# EAGLE design umi9s (EAGLE 8.7.1)

## Sheet 1 of 2: POWER
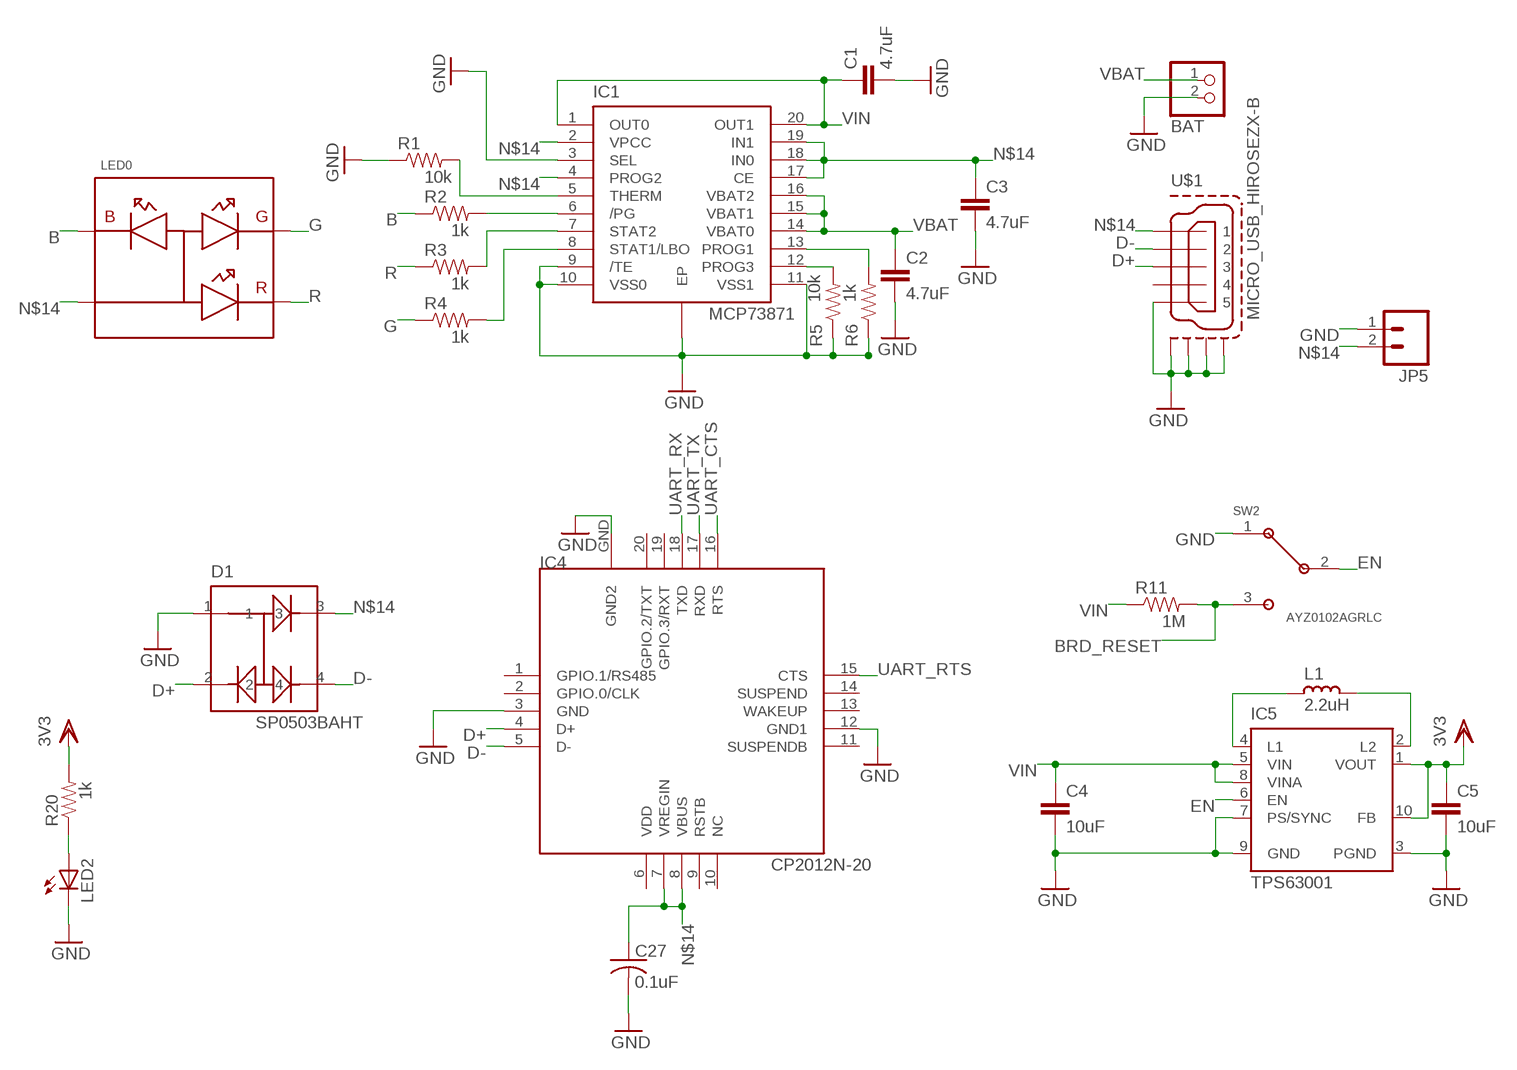
[diagram p0: schematic, sheet 1]

### Parts
BAT  JST_2PIN-SMT  [JST-PH-2-SMT]
C1  4.7uF  C-EUC2012  [C2012]
C2  4.7uF  C-EUC2012  [C2012]
C3  4.7uF  C-EUC2012  [C2012]
C4  10uF  C-EUC2012  [C2012]
C5  10uF  C-EUC2012  [C2012]
C27  0.1uF  C-USC0402  [C0402]
D1  SP0503BAHT  [SOT143]
IC1  MCP73871  [QFN20]
IC4  CP2012N-20  [CP2102-QFN20]
IC5  TPS63001  TPS6300  [DRC-S-PVSON-N10]
JP5  M02PTH  [1X02]
L1  2.2uH  L_1210  [L1210]
LED0  APFA2507LQBDSEEZGKC  [2507_RA_SMD_LED]
LED2  LEDCHIPLED_0603  [CHIPLED_0603]
R1  10k  RESISTOR0402-RES  [0402-RES]
R2  1k  RESISTOR0402-RES  [0402-RES]
R3  1k  RESISTOR0402-RES  [0402-RES]
R4  1k  RESISTOR0402-RES  [0402-RES]
R5  10k  RESISTOR0402-RES  [0402-RES]
R6  1k  RESISTOR0402-RES  [0402-RES]
R11  1M  RESISTOR0402-RES  [0402-RES]
R20  1k  RESISTOR0402-RES  [0402-RES]
SW2  AYZ0102AGRLC  [AYZ0102AGRLC]
U$1  MICRO_USB_HIROSEZX-B  [MICRO_USB_HIROSE_B]

### Nets
B: LED0.1(B) R2.1
BRD_RESET: R11.2 SW2.3 ; also sheet 2
D+: D1.2 IC4.4(D+) U$1.P$3
D-: D1.4 IC4.5(D-) U$1.P$2
EN: IC5.6(EN) SW2.2
G: LED0.4(G) R4.1
GND: BAT.2 C1.2 C2.2 C3.2 C4.2 C5.2 C27.2 D1.1 IC1.3(SEL) IC1.9(/TE) IC1.10(VSS0) IC1.11(VSS1) IC1.EP IC4.3(GND) IC4.12(GND1) IC4.GND(GND2) IC5.3(PGND) IC5.7(PS/SYNC) IC5.9(GND) JP5.1 LED2.C R1.1 R5.1 R6.1 SW2.1 U$1.P$5 U$1.S1 U$1.S2 U$1.S3 U$1.S4 ; also sheet 2
N$1: IC5.4(L1) L1.2
N$2: IC5.2(L2) L1.1
N$14: C3.1 C27.1 D1.3 IC1.2(VPCC) IC1.4(PROG2) IC1.17(CE) IC1.18(IN0) IC1.19(IN1) IC4.7(VREGIN) IC4.8(VBUS) JP5.2 LED0.2(A) U$1.P$1
N$17: IC1.6(/PG) R2.2
N$18: IC1.7(STAT2) R3.2
N$19: LED2.A R20.1
N$29: IC1.8(STAT1/LBO) R4.2
N$30: IC1.5(THERM) R1.2
N$31: IC1.12(PROG3) R5.2
N$32: IC1.13(PROG1) R6.2
R: LED0.3(R) R3.1
UART_CTS: IC4.16(RTS) ; also sheet 2
UART_RTS: IC4.15(CTS) ; also sheet 2
UART_RX: IC4.18(TXD) ; also sheet 2
UART_TX: IC4.17(RXD) ; also sheet 2
VBAT: BAT.1 C2.1 IC1.14(VBAT0) IC1.15(VBAT1) IC1.16(VBAT2)
VDD: C5.1 IC5.1(VOUT) IC5.10(FB) R20.2 ; supply symbol labelled 3V3 ; also sheet 2
VIN: C1.1 C4.1 IC1.1(OUT0) IC1.20(OUT1) IC5.5(VIN) IC5.8(VINA) R11.1
Unconnected: IC4.1(GPIO.1/RS485) IC4.2(GPIO.0/CLK) IC4.9(RSTB) IC4.10(NC) IC4.11(SUSPENDB) IC4.13(WAKEUP) IC4.14(SUSPEND) IC4.19(GPIO.3/RXT) IC4.20(GPIO.2/TXT) IC5.TH U$1.P$4

## Sheet 2 of 2: BGM123
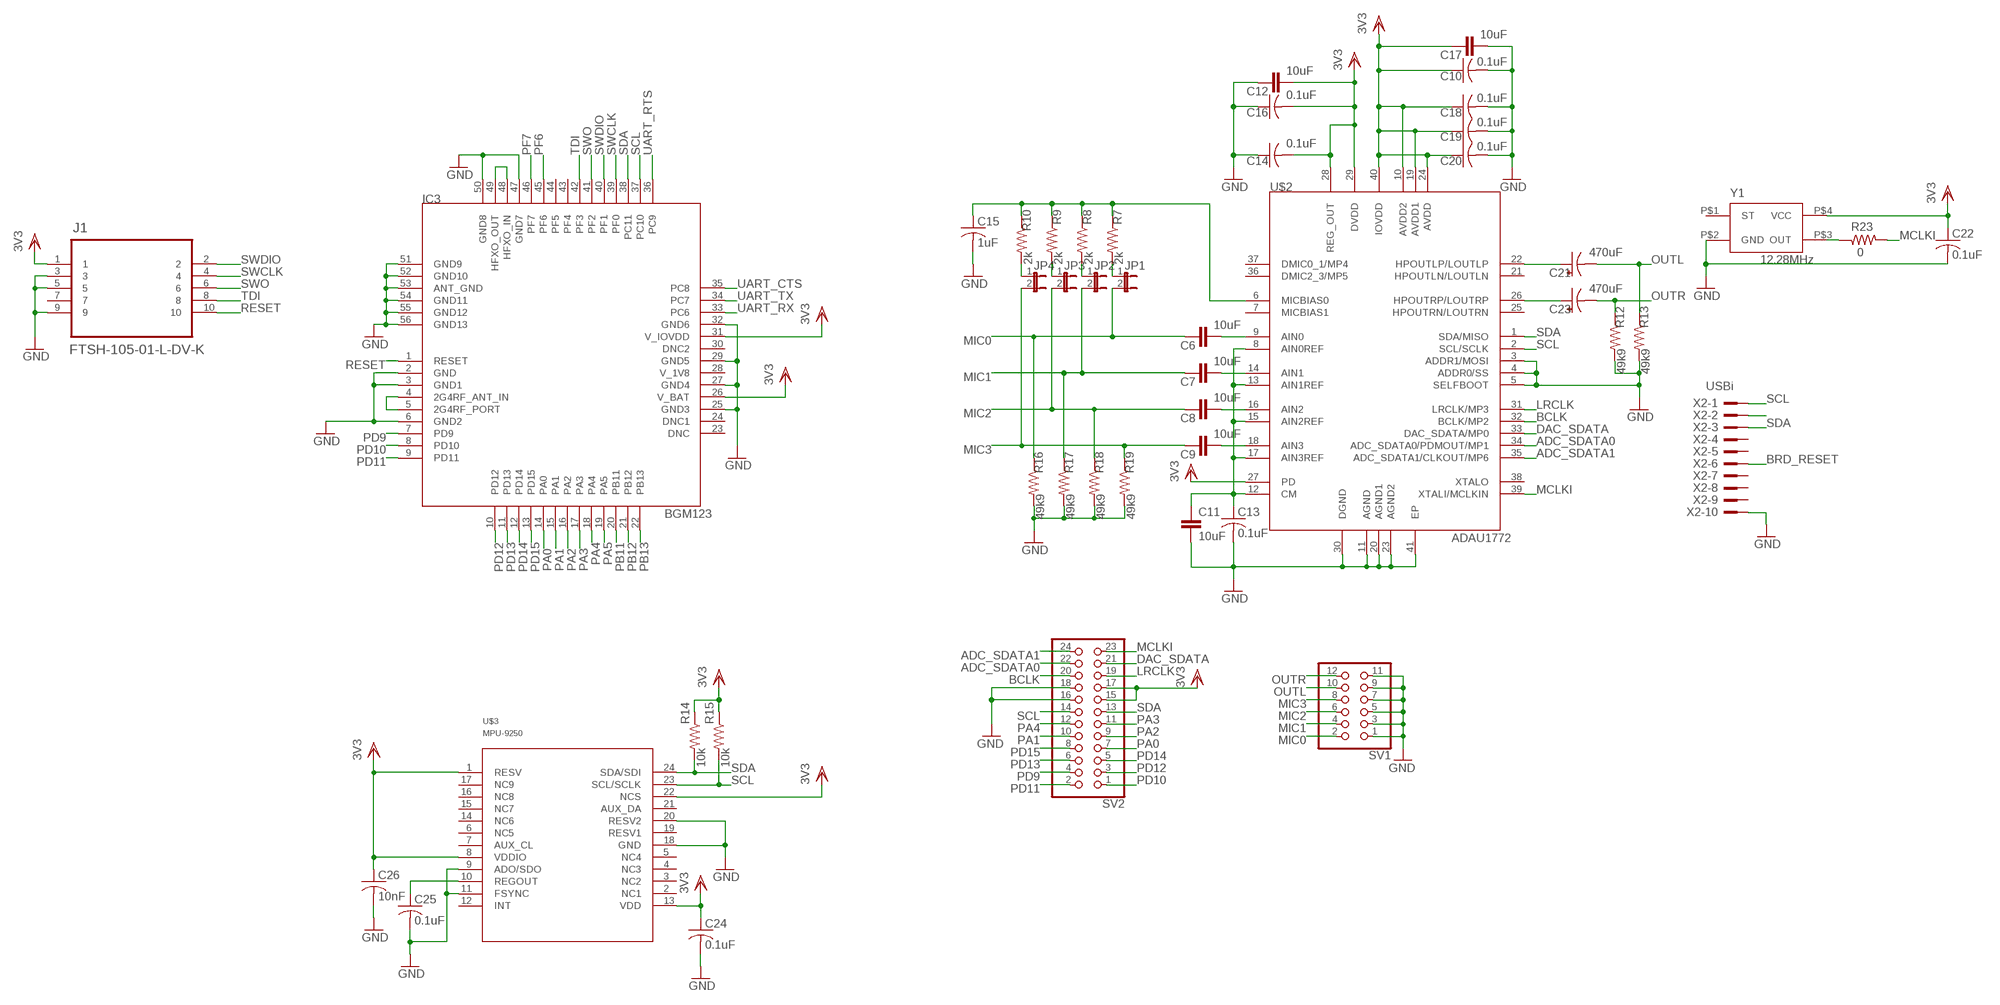
[diagram p1: schematic, sheet 2]

### Parts
C6  10uF  C-EUC2012  [C2012]
C7  10uF  C-EUC2012  [C2012]
C8  10uF  C-EUC2012  [C2012]
C9  10uF  C-EUC2012  [C2012]
C10  0.1uF  C-USC0402  [C0402]
C11  10uF  C-EUC2012  [C2012]
C12  10uF  C-EUC2012  [C2012]
C13  0.1uF  C-USC0402  [C0402]
C14  0.1uF  C-USC0402  [C0402]
C15  1uF  C-USC0402  [C0402]
C16  0.1uF  C-USC0402  [C0402]
C17  10uF  C-EUC2012  [C2012]
C18  0.1uF  C-USC0402  [C0402]
C19  0.1uF  C-USC0402  [C0402]
C20  0.1uF  C-USC0402  [C0402]
C21  470uF  CPOL-USB/3528-21R  [B/3528-21R]
C22  0.1uF  C-USC0402  [C0402]
C23  470uF  CPOL-USB/3528-21R  [B/3528-21R]
C24  0.1uF  C-USC0402  [C0402]
C25  0.1uF  C-USC0402  [C0402]
C26  10nF  C-USC0402  [C0402]
IC3  BGM123  BGM12X  [BGM12X]
J1  FTSH-105-01-L-DV-K  [SAMTEC_FTSH-105-01-L-DV-K]
JP1  JUMPER-2SMD-NO  [SJ_2S-NO]
JP2  JUMPER-2SMD-NO  [SJ_2S-NO]
JP3  JUMPER-2SMD-NO  [SJ_2S-NO]
JP4  JUMPER-2SMD-NO  [SJ_2S-NO]
R7  2k  RESISTOR0402-RES  [0402-RES]
R8  2k  RESISTOR0402-RES  [0402-RES]
R9  2k  RESISTOR0402-RES  [0402-RES]
R10  2k  RESISTOR0402-RES  [0402-RES]
R12  49k9  RESISTOR0402-RES  [0402-RES]
R13  49k9  RESISTOR0402-RES  [0402-RES]
R14  10k  RESISTOR0402-RES  [0402-RES]
R15  10k  RESISTOR0402-RES  [0402-RES]
R16  49k9  RESISTOR0402-RES  [0402-RES]
R17  49k9  RESISTOR0402-RES  [0402-RES]
R18  49k9  RESISTOR0402-RES  [0402-RES]
R19  49k9  RESISTOR0402-RES  [0402-RES]
R23  0  RESISTOR0402-RES  [0402-RES]
SV1  PINHD-2X06  [2X06ROUND]
SV2  PINHD-2X12  [2X12ROUND]
U$2  ADAU1772  [QFN40_600X600]
U$3  MPU-9250  [LEAD-QFN24]
X2  USBi  2510-  [PAK100/2500-10]
Y1  12.28MHz  XTAL-OSC  [SG-210]

### Nets
ADC_SDATA0: SV2.22 U$2.34(ADC_SDATA0/PDMOUT/MP1)
ADC_SDATA1: SV2.24 U$2.35(ADC_SDATA1/CLKOUT/MP6)
AIN0: C6.2 U$2.9(AIN0)
AIN1: C7.2 U$2.14(AIN1)
AIN2: C8.2 U$2.16(AIN2)
AIN3: C9.2 U$2.18(AIN3)
BCLK: SV2.20 U$2.32(BCLK/MP2)
BRD_RESET: X2.6 ; also sheet 1
CM: C11.1 C13.1 U$2.8(AIN0REF) U$2.12(CM) U$2.13(AIN1REF) U$2.15(AIN2REF) U$2.17(AIN3REF)
DAC_SDATA: SV2.21 U$2.33(DAC_SDATA/MP0)
GND: C10.2 C11.2 C12.1 C13.2 C14.1 C15.2 C16.1 C17.2 C18.2 C19.2 C20.2 C22.2 C24.2 C25.2 C26.2 IC3.2(GND) IC3.3(GND1) IC3.6(GND2) IC3.25(GND3) IC3.27(GND4) IC3.29(GND5) IC3.32(GND6) IC3.47(GND7) IC3.50(GND8) IC3.51(GND9) IC3.52(GND10) IC3.53(ANT_GND) IC3.54(GND11) IC3.55(GND12) IC3.56(GND13) J1.3 J1.5 J1.9 R12.2 R13.2 R16.2 R17.2 R18.2 R19.2 SV1.1 SV1.3 SV1.5 SV1.7 SV1.9 SV1.11 SV2.16 SV2.18 U$2.3(ADDR1/MOSI) U$2.4(ADDR0/SS) U$2.5(SELFBOOT) U$2.11(AGND) U$2.20(AGND1) U$2.23(AGND2) U$2.30(DGND) U$2.41(EP) U$3.9(ADO/SDO) U$3.11(FSYNC) U$3.18(GND) U$3.20(RESV2) X2.10 Y1.P$2(GND) ; also sheet 1
HPOUTL: C21.+ U$2.22(HPOUTLP/LOUTLP)
HPOUTR: C23.+ U$2.26(HPOUTRP/LOUTRP)
LRCLK: SV2.19 U$2.31(LRCLK/MP3)
MCLKI: R23.2 SV2.23 U$2.39(XTALI/MCLKIN)
MIC0: C6.1 JP1.2 R16.1 SV1.2
MIC1: C7.1 JP2.2 R17.1 SV1.4
MIC2: C8.1 JP3.2 R18.1 SV1.6
MIC3: C9.1 JP4.2 R19.1 SV1.8
MICBIAS0: C15.1 R7.1 R8.1 R9.1 R10.1 U$2.6(MICBIAS0)
N$3: IC3.48(HFXO_IN) IC3.49(HFXO_OUT)
N$4: IC3.4(2G4RF_ANT_IN) IC3.5(2G4RF_PORT)
N$5: C25.1 U$3.10(REGOUT)
N$6: JP1.1 R7.2
N$7: JP2.1 R8.2
N$8: JP3.1 R9.2
N$9: R23.1 Y1.P$3(OUT)
N$10: JP4.1 R10.2
N$11: X2.2
OUTL: C21.- R13.1 SV1.10
OUTR: C23.- R12.1 SV1.12
PA0: IC3.14(PA0) SV2.7
PA1: IC3.15(PA1) SV2.10
PA2: IC3.16(PA2) SV2.9
PA3: IC3.17(PA3) SV2.11
PA4: IC3.18(PA4) SV2.12
PA5: IC3.19(PA5)
PB11: IC3.20(PB11)
PB12: IC3.21(PB12)
PB13: IC3.22(PB13)
PD9: IC3.7(PD9) SV2.4
PD10: IC3.8(PD10) SV2.1
PD11: IC3.9(PD11) SV2.2
PD12: IC3.10(PD12) SV2.3
PD13: IC3.11(PD13) SV2.6
PD14: IC3.12(PD14) SV2.5
PD15: IC3.13(PD15) SV2.8
PF6: IC3.45(PF6)
PF7: IC3.46(PF7)
RESET: IC3.1(RESET) J1.10
SCL: IC3.37(PC10) R15.2 SV2.14 U$2.2(SCL/SCLK) U$3.23(SCL/SCLK) X2.1
SDA: IC3.38(PC11) R14.2 SV2.13 U$2.1(SDA/MISO) U$3.24(SDA/SDI) X2.3
SWCLK: IC3.39(PF0) J1.4
SWDIO: IC3.40(PF1) J1.2
SWO: IC3.41(PF2) J1.6
TDI: IC3.42(PF3) J1.8
UART_CTS: IC3.35(PC8) ; also sheet 1
UART_RTS: IC3.36(PC9) ; also sheet 1
UART_RX: IC3.33(PC6) ; also sheet 1
UART_TX: IC3.34(PC7) ; also sheet 1
VDD: C10.1 C12.2 C14.2 C16.2 C17.1 C18.1 C19.1 C20.1 C22.1 C24.1 C26.1 IC3.26(V_BAT) IC3.31(V_IOVDD) J1.1 R14.1 R15.1 SV2.15 SV2.17 U$2.10(AVDD2) U$2.19(AVDD1) U$2.24(AVDD) U$2.27(PD) U$2.28(REG_OUT) U$2.29(DVDD) U$2.40(IOVDD) U$3.1(RESV) U$3.8(VDDIO) U$3.13(VDD) U$3.22(NCS) Y1.P$4(VCC) ; supply symbol labelled 3V3 ; also sheet 1
Unconnected: IC3.23(DNC) IC3.24(DNC1) IC3.43(PF4) IC3.44(PF5) J1.7 U$2.7(MICBIAS1) U$2.21(HPOUTLN/LOUTLN) U$2.25(HPOUTRN/LOUTRN) U$2.36(DMIC2_3/MP5) U$2.37(DMIC0_1/MP4) U$2.38(XTALO) U$3.2(NC1) U$3.3(NC2) U$3.4(NC3) U$3.5(NC4) U$3.6(NC5) U$3.7(AUX_CL) U$3.12(INT) U$3.14(NC6) U$3.15(NC7) U$3.16(NC8) U$3.17(NC9) U$3.19(RESV1) U$3.21(AUX_DA) X2.4 X2.5 X2.7 X2.8 X2.9 Y1.P$1(ST)

## Power pins joined to a net without a drawn wire
DNC2: IC3.30(DNC2)
V_1V8: IC3.28(V_1V8)
VDD: IC4.6(VDD)

## Library data of the parts
BAT = tkrworks:JST_2PIN: JST 2-Pin Connectors of various flavors SMT-RA (S2B-PH-SM4) 4UConnector #17311 SMT (B2B-PH-SM4) THM-RA (S2B-PH) THM (B2B-PH)
C1-C9 C11 C12 C17 = rcl:C-EU: CAPACITOR, European symbol
C10 C13-C16 C18-C20 C22 C24-C27 = rcl:C-US: CAPACITOR, American symbol; SPICEPREFIX: C
C21 C23 = rcl:CPOL-US: POLARIZED CAPACITOR, American symbol; SPICEPREFIX: C
D1 = tkrworks:SP0503BAHT
IC1 = tkrworks:MCP73871
IC3 = tkrworks:BGM12X
IC4 = tkrworks:CP2012N-20
IC5 = texas:TPS6300*: HIGH EFFICIENT SINGLE INDUCTOR BUCK-BOOST CONVERTER WITH 1.8-A SWITCHES Source: http://focus.ti.com/lit/ds/symlink/tps63001.pdf; MPN: TPS63000DRCTG4; OC_FARNELL: 1511852; OC_NEWARK: 59M7217
J1 = SAMTEC-HTSW-FTxx_By_element14_Batch_1:FTSH-105-01-L-DV-K: CONN HEADER, 1.27MM, 2X5WAY, SMT; MPN: FTSH-105-01-L-DV-K; OC_FARNELL: -; OC_NEWARK: 02M8557; PACKAGE: HEADER, 1.27MM, 2X5WAY, SMT; SUPPLIER: SAMTEC
JP1-JP4 = SparkFun:JUMPER-2: Jumper Basic 0.1" spaced jumper. Use with breakaway headers.
JP5 = SparkFun:M02: Header 2 Standard 2-pin 0.1" header. Use with straight break away headers (SKU : PRT-00116), right angle break away headers (PRT-00553), swiss pins (PRT-00743), machine pins (PRT-00117), and female headers (PRT-00115). Molex polarized connector foot print use with SKU : PRT-08233 with associated crimp pins and housings.
L1 = rc-master-smd:L_: INDUCTOR
LED0 = tkrworks:APFA2507LQBDSEEZGKC
LED2 = led:LED: LED OSRAM: - CHIPLED LG R971, LG N971, LY N971, LG Q971, LY Q971, LO R971, LY R971 LH N974, LH R974 LS Q976, LO Q976, LY Q976 LO Q996 - Hyper CHIPLED LW Q18S LB Q993, LB Q99A, LB R99A - SideLED LS A670, LO A670, LY A670, LG A670, LP A670 LB A673, LV A673, LT A673, LW A673 LH A674 LY A675 LS A676, LA A676, LO A676, LY A676, LW A676 LS A679, LY A679, LG A679 - Hyper Micro SIDELED® LS Y876, LA Y876, LO Y876, LY Y876 LT Y87S - SmartLED LW L88C, LW L88S LB L89C, LB L89S, LG L890 LS L89K, LO L89K, LY L89K LS L896, LA L896, LO L896, LY L896 - TOPLED LS T670, LO T670, LY T670, LG T670, LP T670 LSG T670, LSP T670, LSY T670, LOP T670, LYG T670 LG T671, LOG T671, LSG T671 LB T673, LV T673, LT T673, LW T673 LH T674 LS T676, LA T676, LO T676, LY T676, LB T676, LH T676, LSB T676, LW T676 LB T67C, LV T67C, LT T67C, LS T67K, LO T67K, LY T67K, LW E67C LS E67B, LA E67B, LO E67B, LY E67B, LB E67C, LV E67C, LT E67C LW T67C LS T679, LY T679, LG T679 LS T770, LO T770, LY T770, LG T770, LP T770 LB T773, LV T773, LT T773, LW T773 LH T774 LS E675, LA E675, LY E675, LS T675 LS T776, LA T776, LO T776, LY T776, LB T776 LHGB T686 LT T68C, LB T68C - Hyper Mini TOPLED® LB M676 - Mini TOPLED Santana® LG M470 LS M47K, LO M47K, LY M47K Source: http://www.osram.convergy.de LUXEON: - LUMILED® LXK2-PW12-R00, LXK2-PW12-S00, LXK2-PW14-U00, LXK2-PW14-V00 LXK2-PM12-R00, LXK2-PM12-S00, LXK2-PM14-U00 LXK2-PE12-Q00, LXK2-PE12-R00, LXK2-PE12-S00, LXK2-PE14-T00, LXK2-PE14-U00 LXK2-PB12-K00, LXK2-PB12-L00, LXK2-PB12-M00, LXK2-PB14-N00, LXK2-PB14-P00, LXK2-PB14-Q00 LXK2-PR12-L00, LXK2-PR12-M00, LXK2-PR14-Q00, LXK2-PR14-R00 LXK2-PD12-Q00, LXK2-PD12-R00, LXK2-PD12-S00 LXK2-PH12-R00, LXK2-PH12-S00 LXK2-PL12-P00, LXK2-PL12-Q00, LXK2-PL12-R00 Source: www.luxeon.com KINGBRIGHT: KA-3528ASYC Source: www.kingbright.com
R1-R20 R23 = SparkFun:RESISTOR: Resistor Basic schematic elements and footprints for 0603, 1206, and PTH resistors.
SV1 = pinhead-2:PINHD-2X06: PIN HEADER
SV2 = pinhead-2:PINHD-2X12: PIN HEADER
SW2 = tkrworks:AYZ0102AGRLC
U$1 = tkrworks:MICRO_USB_HIROSE
U$2 = tkrworks:ADAU1772
U$3 = invensense:MPU-9250
X2 = con-3m:2510-: 3M (TM) Pak 100 4-Wall Header Source: 3M; MF: 3M; MPN: 2510-6002UB; OC_FARNELL: 9838244; OC_NEWARK: 46F4725
Y1 = tkrworks2:XTAL-OSC

## Net classes
1 OUT: width 0.406 mm

## Board
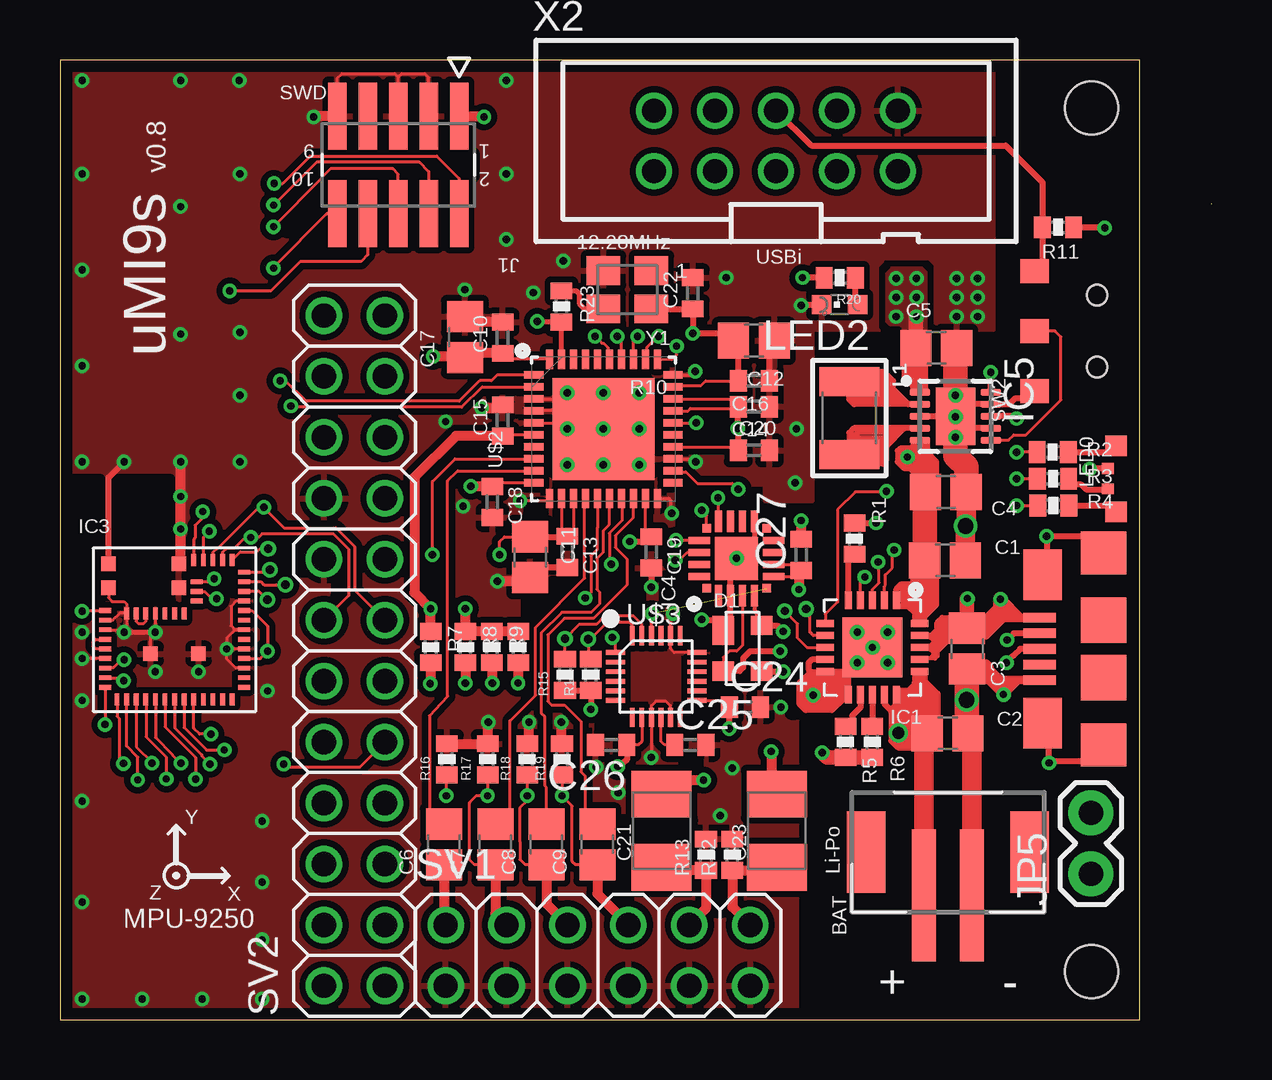
[diagram p2: board, top side]
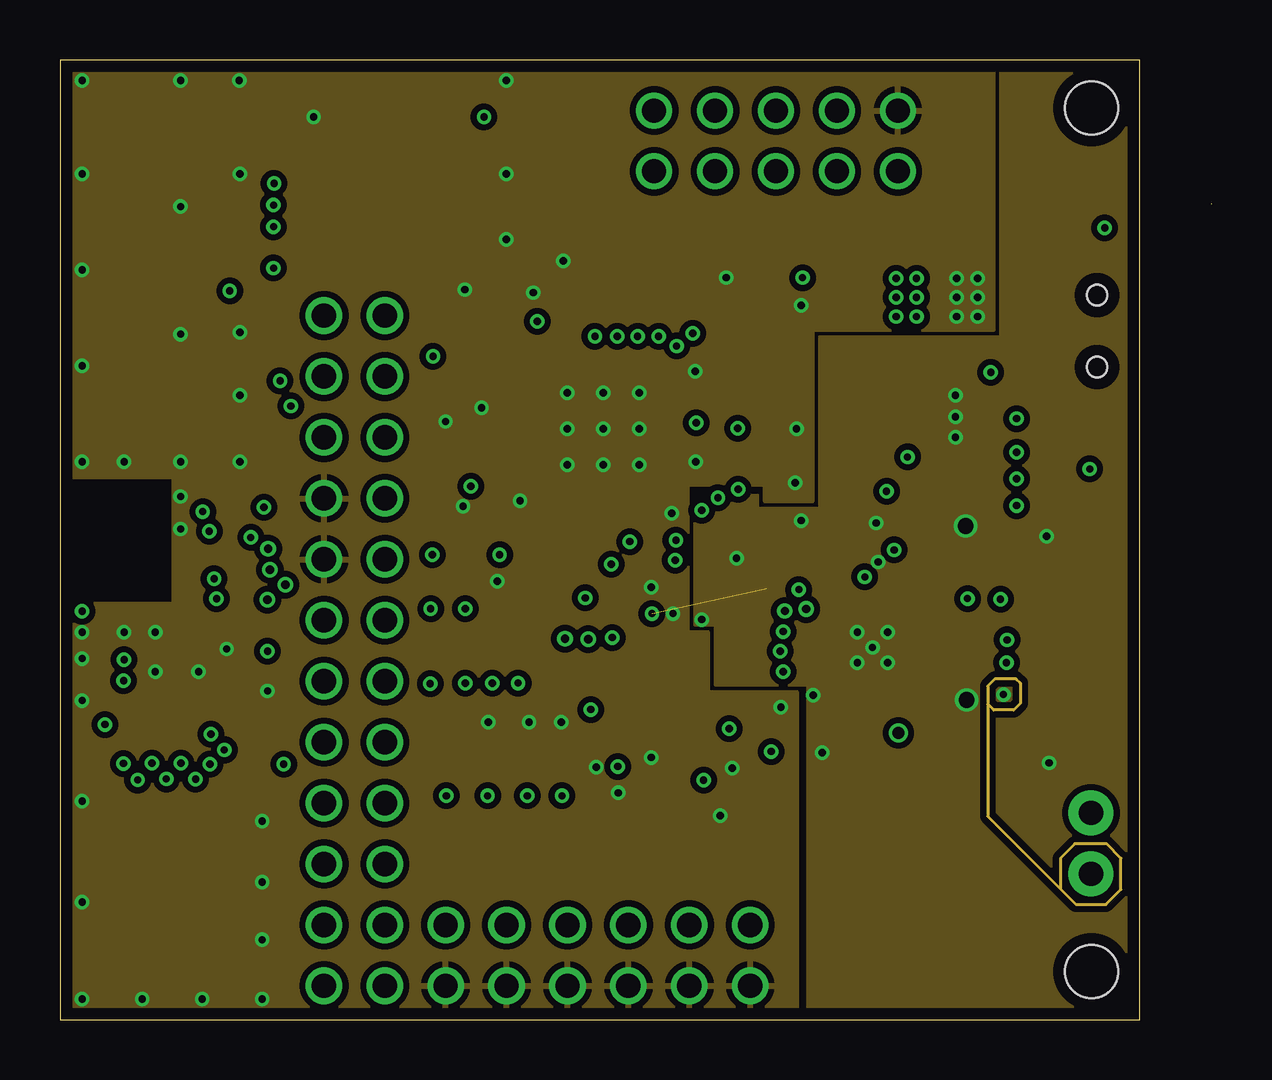
[diagram p3: board, inner layer Route2]
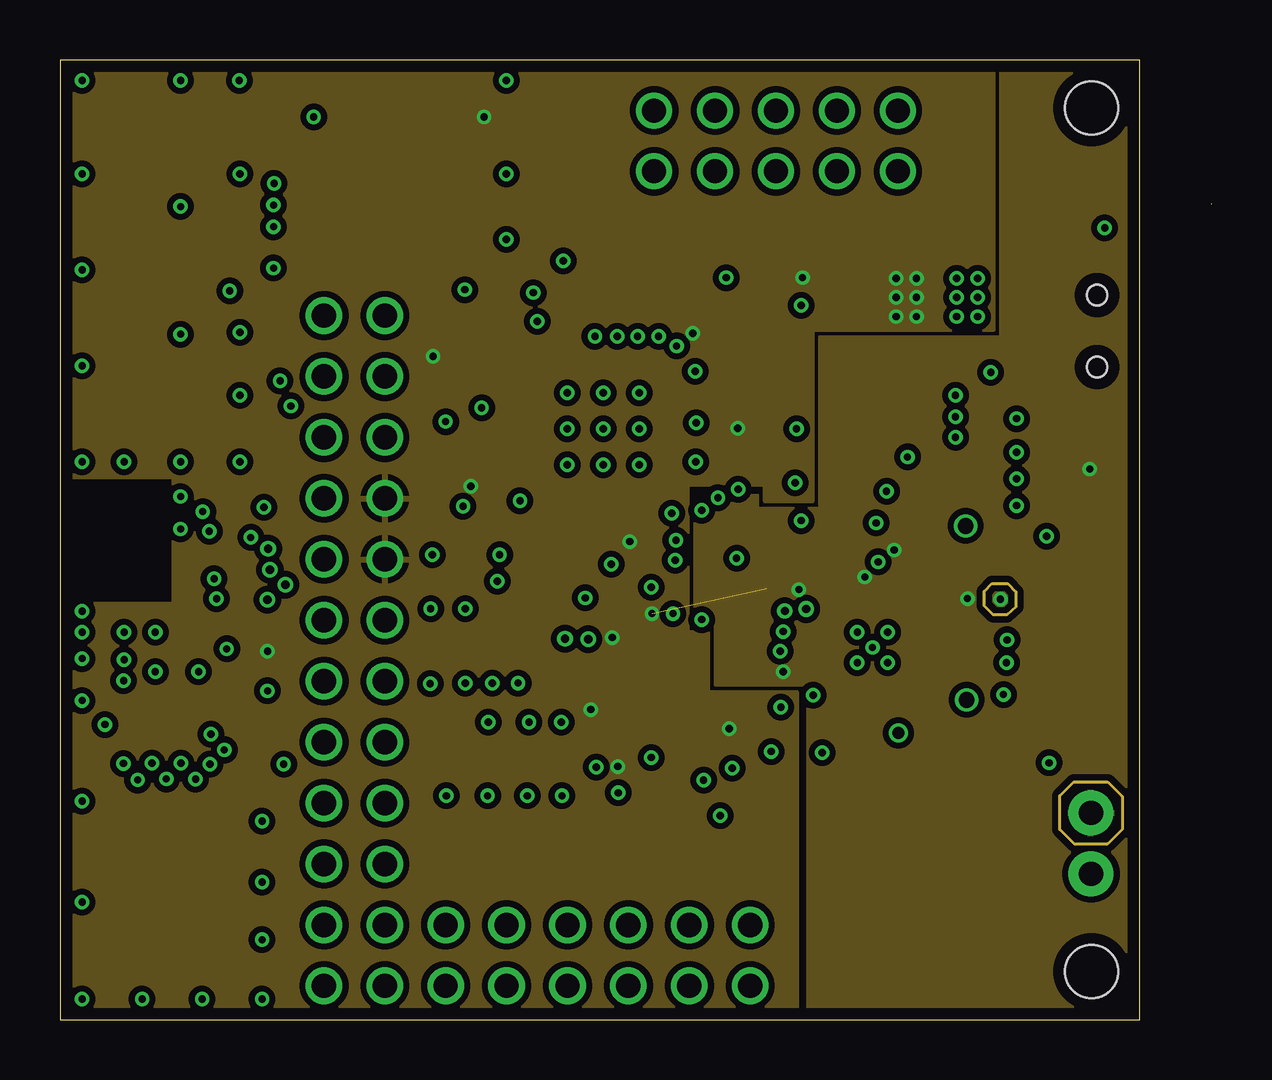
[diagram p4: board, inner layer Route3]
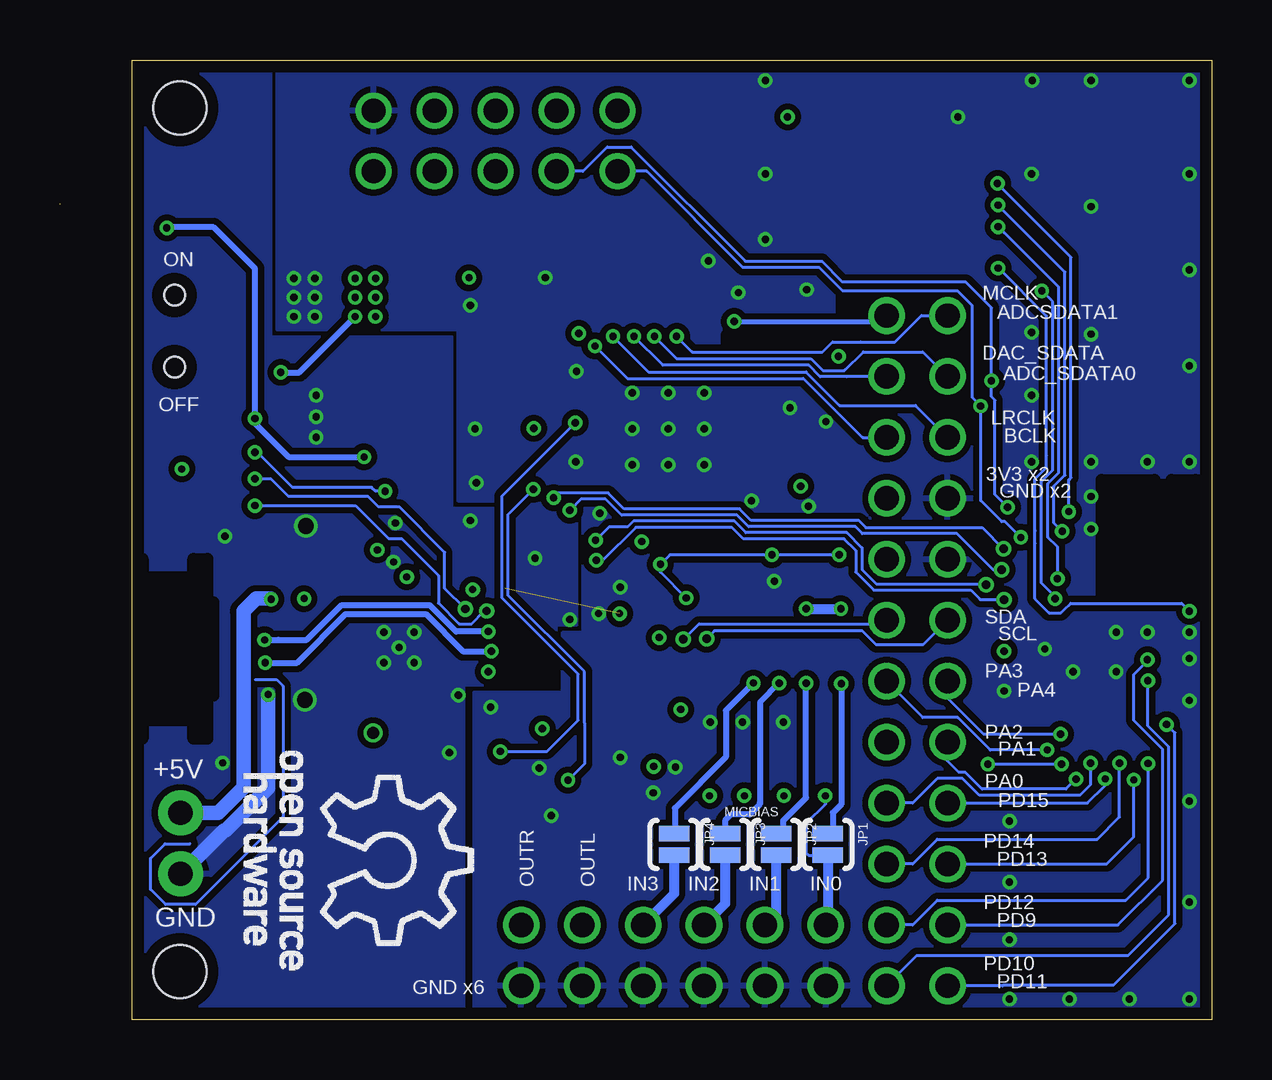
[diagram p5: board, bottom side, seen from below]

Size 48 x 40 mm. Coordinates in mm from the lower left corner, seen from the top.
Outline: 48,34 arc0 48,34.01
Outline: 0,0 45,0 45,40 0,40 0,0
Copper layers (1+2*3+16): Top 0.018mm / dielectric 0.25mm / Route2 0.035mm / dielectric 1mm / Route3 0.035mm / dielectric 0.2mm / Bottom 0.018mm
Design rules "pban_5mil-l4-a *": minimum track width 5mil, minimum drill 0.3mm, track to track 0.125mm, track to pad 0.2mm, pad to pad 0.125mm, via to via 0.125mm, smd to smd 0.125mm, copper to edge 0.5mm, drill to drill 0.5mm, minimum pad ring 0.15mm, minimum via ring 0.15mm, stop-mask expansion 4mil, vias tented up to drill 0.35mm, thermal gap 10mil
Holes 2.2 mm at 43,2 43,38
tRestrict: area 1.6,16.4 to 2.1,16.6; area 22.4,22.4 to 22.9,22.5; area 20.4,24.4 to 20.5,24.8; area 22.4,26.8 to 22.9,26.9; area 24.8,24.4 to 24.9,24.8; area 19.6,25.5 to 19.9,25.7; area 19.6,25 to 19.9,25.2; area 14.5,37.5 to 15,37.8; area 23.8,17 to 24.2,18.3; area 25.2,17.4 to 26.1,18.5; area 26,16.8 to 26.3,17.3; area 19.5,21.1 to 20.1,21.5; 21 more areas
bRestrict: area 37.8,15.4 to 38.8,15.7; area 14.3,28.4 to 19.4,28.9; area 14.4,29.3 to 15.4,30.1; area 19.6,28.1 to 20.2,28.6

### Footprints (pad centres in the part's own frame; a part is rotated, then mirrored left to right if it is on the bottom)
JST-PH-2-SMT = smd 1 x 5.5: 1 -1,-1.8; 2 1,-1.8 | smd 1.6 x 3.4: NC1 -3.4,0; NC2 3.4,0
C2012 = smd 1.3 x 1.5: 1 -0.85,0; 2 0.85,0
C0402 = smd 0.7 x 0.9: 1 -0.65,0; 2 0.65,0
B/3528-21R = smd 1.95 x 2.5: + 1.525,0; - -1.525,0
SOT143 = smd 0.9 x 1.2: 1 -0.8,0.75 | smd 0.9 x 0.8: 2 -0.8,-0.95; 3 0.8,-0.95; 4 0.8,0.95
QFN20 = smd 0.73 x 0.3: 1 -1.965,1; 2 -1.965,0.5; 3 -1.965,0; 4 -1.965,-0.5; 5 -1.965,-1; 11 1.965,-1; 12 1.965,-0.5; 13 1.965,0; 14 1.965,0.5; 15 1.965,1 | smd 0.3 x 0.73: 6 -1,-1.965; 7 -0.5,-1.965; 8 0,-1.965; 9 0.5,-1.965; 10 1,-1.965; 16 1,1.965; 17 0.5,1.965; 18 0,1.965; 19 -0.5,1.965; 20 -1,1.965 | smd 2.5 x 2.5: EP 0,0
BGM12X = smd 0.5 x 0.2: 1 -0.15,-1.95; 2 -0.15,-2.35; 3 -0.15,-2.75; 4 -0.15,-3.15; 5 -0.15,-3.55; 6 -0.15,-3.95; 7 -0.15,-4.35; 8 -0.15,-4.75; 9 -0.15,-5.15; 23 5.65,-5.15; 24 5.65,-4.75; 25 5.65,-4.35; 26 5.65,-3.95; 27 5.65,-3.55; 28 5.65,-3.15; 29 5.65,-2.75; 30 5.65,-2.35; 31 5.65,-1.95; 32 5.65,-1.55; 33 5.65,-1.15; 34 5.65,-0.75; 35 5.65,-0.35; 41 3.675,-0.75; 42 3.675,-1.15; 43 3.675,-1.55 | smd 0.2 x 0.5: 10 0.35,-5.65; 11 0.75,-5.65; 12 1.15,-5.65; 13 1.55,-5.65; 14 1.95,-5.65; 15 2.35,-5.65; 16 2.75,-5.65; 17 3.15,-5.65; 18 3.55,-5.65; 19 3.95,-5.65; 20 4.35,-5.65; 21 4.75,-5.65; 22 5.15,-5.65; 36 5.15,0.15; 37 4.75,0.15; 38 4.35,0.15; 39 3.95,0.15; 40 3.55,0.15; 44 3.15,-2.075; 45 2.75,-2.075; 46 2.35,-2.075; 47 1.95,-2.075; 48 1.55,-2.075; 49 1.15,-2.075; 50 0.75,-2.075 | smd 0.6 x 0.6: 51 1.75,-3.75; 52 3.75,-3.75; 53 0,0; 54 0,-1; 55 2.925,-1; 56 2.925,0
CP2102-QFN20 = smd 0.35 x 0.35: 1 -1.25,1.25; 6 -1.25,-1.25; 11 1.25,-1.25; 16 1.25,1.25 | smd 0.9 x 0.3: 2 -1.55,0.75; 3 -1.55,0.25; 4 -1.55,-0.25; 5 -1.55,-0.75; 12 1.55,-0.75; 13 1.55,-0.25; 14 1.55,0.25; 15 1.55,0.75 | smd 0.3 x 0.9: 7 -0.75,-1.55; 8 -0.25,-1.55; 9 0.25,-1.55; 10 0.75,-1.55; 17 0.75,1.55; 18 0.25,1.55; 19 -0.25,1.55; 20 -0.75,1.55 | smd 1.8 x 1.8: GND 0,0
DRC-S-PVSON-N10 = smd 0.28 x 0.85: 1 -1,-1.475; 2 -0.5,-1.475; 3 0,-1.475; 4 0.5,-1.475; 5 1,-1.475; 6 1,1.475; 7 0.5,1.475; 8 0,1.475; 9 -0.5,1.475; 10 -1,1.475 | smd 2.4 x 1.65: TH 0,0
SAMTEC_FTSH-105-01-L-DV-K = smd 0.762 x 2.794: 1 -2.54,-2.032; 2 -2.54,2.032; 3 -1.27,-2.032; 4 -1.27,2.032; 5 0,-2.032; 6 0,2.032; 7 1.27,-2.032; 8 1.27,2.032; 9 2.54,-2.032; 10 2.54,2.032
SJ_2S-NO = smd 0.635 x 1.27: 1 -0.45,0; 2 0.45,0
1X02 = drill 1.016 pad 1.88: 1 0,0; 2 2.54,0
L1210 = smd 1.2 x 2.5: 1 -1.524,0; 2 1.524,0
2507_RA_SMD_LED = smd 0.85 x 0.9: 1 -1.375,0; 4 1.375,0 | smd 0.45 x 0.5: 2 -0.425,-0.35; 3 0.425,-0.35
CHIPLED_0603 = smd 0.8 x 0.8: A 0,-0.75; C 0,0.75
0402-RES = smd 0.7 x 0.9: 1 -0.65,0; 2 0.65,0
2X06ROUND = drill 1.016: 1 -6.35,-1.27; 2 -6.35,1.27; 3 -3.81,-1.27; 4 -3.81,1.27; 5 -1.27,-1.27; 6 -1.27,1.27; 7 1.27,-1.27; 8 1.27,1.27; 9 3.81,-1.27; 10 3.81,1.27; 11 6.35,-1.27; 12 6.35,1.27
2X12ROUND = drill 1.016: 1 -13.97,-1.27; 2 -13.97,1.27; 3 -11.43,-1.27; 4 -11.43,1.27; 5 -8.89,-1.27; 6 -8.89,1.27; 7 -6.35,-1.27; 8 -6.35,1.27; 9 -3.81,-1.27; 10 -3.81,1.27; 11 -1.27,-1.27; 12 -1.27,1.27; 13 1.27,-1.27; 14 1.27,1.27; 15 3.81,-1.27; 16 3.81,1.27; 17 6.35,-1.27; 18 6.35,1.27; 19 8.89,-1.27; 20 8.89,1.27; 21 11.43,-1.27; 22 11.43,1.27; 23 13.97,-1.27; 24 13.97,1.27
AYZ0102AGRLC = smd 1 x 1.2: 1 -2.5,2.6; 2 0,2.6; 3 2.5,2.6 | hole 0.85: -1.5,0; 1.5,0
MICRO_USB_HIROSE_B = smd 0.4 x 1.35: P$1 1.3,2.675; P$2 0.65,2.675; P$3 0,2.675; P$4 -0.65,2.675; P$5 -1.3,2.675 | smd 2.1 x 1.6: S1 3.1,2.55; S2 -3.1,2.55 | smd 1.8 x 1.9: S3 4,0; S4 -4,0 | smd 1.9 x 1.9: S5 -1.2,0; S6 1.2,0
QFN40_600X600 = smd 0.8 x 0.3: 1 -2.9,2.25; 2 -2.9,1.75; 3 -2.9,1.25; 4 -2.9,0.75; 5 -2.9,0.25; 6 -2.9,-0.25; 7 -2.9,-0.75; 8 -2.9,-1.25; 9 -2.9,-1.75; 10 -2.9,-2.25; 21 2.9,-2.25; 22 2.9,-1.75; 23 2.9,-1.25; 24 2.9,-0.75; 25 2.9,-0.25; 26 2.9,0.25; 27 2.9,0.75; 28 2.9,1.25; 29 2.9,1.75; 30 2.9,2.25 | smd 0.3 x 0.8: 11 -2.25,-2.9; 12 -1.75,-2.9; 13 -1.25,-2.9; 14 -0.75,-2.9; 15 -0.25,-2.9; 16 0.25,-2.9; 17 0.75,-2.9; 18 1.25,-2.9; 19 1.75,-2.9; 20 2.25,-2.9; 31 2.25,2.9; 32 1.75,2.9; 33 1.25,2.9; 34 0.75,2.9; 35 0.25,2.9; 36 -0.25,2.9; 37 -0.75,2.9; 38 -1.25,2.9; 39 -1.75,2.9; 40 -2.25,2.9 | smd 4.25 x 4.25: 41 0,0
LEAD-QFN24 = smd 0.8 x 0.2: 1 -1.7,1; 2 -1.7,0.6; 3 -1.7,0.2; 4 -1.7,-0.2; 5 -1.7,-0.6; 6 -1.7,-1; 13 1.7,-1; 14 1.7,-0.6; 15 1.7,-0.2; 16 1.7,0.2; 17 1.7,0.6; 18 1.7,1 | smd 0.2 x 0.8: 7 -1,-1.7; 8 -0.6,-1.7; 9 -0.2,-1.7; 10 0.2,-1.7; 11 0.6,-1.7; 12 1,-1.7; 19 1,1.7; 20 0.6,1.7; 21 0.2,1.7; 22 -0.2,1.7; 23 -0.6,1.7; 24 -1,1.7
PAK100/2500-10 = drill 1 pad 1.422: 1 -5.08,-1.27; 2 -5.08,1.27; 3 -2.54,-1.27; 4 -2.54,1.27; 5 0,-1.27; 6 0,1.27; 7 2.54,-1.27; 8 2.54,1.27; 9 5.08,-1.27; 10 5.08,1.27
SG-210 = smd 1.4 x 1.2: P$1 -1,-0.8; P$2 1,-0.8; P$3 1,0.8; P$4 -1,0.8

### Placement (x,y rotation side)
BAT  37.01,6.97 0 top
C1  36.89,19.15 0 top
C2  37,11.93 0 top
C3  37.81,15.46 270 top
C4  36.92,21.99 0 top
C5  36.52,28 0 top
C6  16,7.3 90 top
C7  18.15,7.3 90 top
C8  20.27,7.3 90 top
C9  22.4,7.3 90 top
C10  18.45,28.43 90 top
C11  19.6,19.27 270 top
C12  28.93,28.3 180 top
C13  21.15,19.5 270 top
C14  28.93,25.55 180 top
C15  18.45,24.98 90 top
C16  28.93,26.62 180 top
C17  16.88,28.45 90 top
C18  18.02,21.57 270 top
C19  24.65,19.48 270 top
C20  28.93,23.73 0 top
C21  25.07,7.88 90 top
C22  26.38,30.27 90 top
C23  29.88,7.88 90 top
C24  28.55,13.03 0 top
C25  26.27,11.45 0 top
C26  22.98,11.45 180 top
C27  30.9,19.38 90 top
D1  28.45,15.47 0 top
IC1  33.87,15.51 270 top
IC3  2.02,19 0 top
IC4  28.2,19.23 90 top
IC5  37.33,25.15 270 top
J1  14.1,35.62 180 top
JP1  16,7.3 270 bottom
JP2  18.15,7.3 270 bottom
JP3  20.27,7.3 270 bottom
JP4  22.4,7.3 270 bottom
JP5  42.98,6.08 90 top
L1  32.9,25.07 270 top
LED0  44.02,22.55 270 top
LED2  32.5,29.8 90 top
R1  33.12,20.05 270 top
R2  41.38,23.66 180 top
R3  41.39,22.54 180 top
R4  41.41,21.43 180 top
R5  32.74,11.57 90 top
R6  33.86,11.57 90 top
R7  15.45,15.53 270 top
R8  16.9,15.53 270 top
R9  18,15.53 270 top
R10  19.1,15.53 270 top
R11  41.6,33.02 180 top
R12  28.02,6.88 90 top
R13  26.93,6.88 90 top
R14  22.12,14.38 90 top
R15  21.05,14.38 90 top
R16  16.12,10.85 90 top
R17  17.82,10.85 90 top
R18  19.48,10.85 90 top
R19  20.93,10.85 90 top
R20  32.5,30.93 180 top
R23  20.9,29.73 270 top
SV1  22.43,2.67 0 top
SV2  12.28,15.38 90 top
SW2  43.23,28.7 90 top
U$1  43.5,15.45 90 top
U$2  22.65,24.62 0 top
U$3  24.85,14.3 0 top
X2  29.85,36.62 0 top
Y1  23.65,30.43 180 top

### Tracks (layer width: path | path; a pad name or v marks a point on that pad's centre or on a via)
ADC_SDATA0  (via drill 0.3)
  Top 0.13: U$2.34 23.4,28.3 v23.23,28.48
  Bottom 0.13: SV2.22 12.03,27.83 14.52,27.83 15.28,27.07 15.29,27.07 15.3,27.06 16.21,27.06 16.7,27.55 22.3,27.55 v23.23,28.48
ADC_SDATA1  (via drill 0.3)
  Top 0.13: v22.3,28.48 22.59,28.19 22.66,28.19 22.84,28.01 22.84,27.59 U$2.35
  Bottom 0.13: SV2.24 12.09,29.34 13.12,28.32 13.19,28.25 14.62,28.25 14.63,28.24 15.8,28.24 16.21,27.82 21.65,27.82 v22.3,28.48
AIN0
  Top 0.13: 16.21,8.34 16.02,8.15 C6.2 15.4,8.75 15.4,12.66 16.16,13.47 16.16,22.46 16.57,22.88 U$2.9
AIN1
  Top 0.13: 18.3,8.3 C7.2 18.76,8.76 18.76,12.45 19.82,13.52 19.82,16.35 21.87,18.4 21.87,21.7 U$2.14
AIN2
  Top 0.13: U$2.16 22.9,20.64 22.65,20.38 22.65,19.49 22.38,19.22 22.38,17.93 22.49,17.82 22.49,17.33 22.14,16.98 20.92,16.98 20.08,16.14 20.08,12.76 20.21,12.63 20.21,9.74 20.27,9.68 C8.2
AIN3
  Top 0.13: C9.2 21.88,8.68 21.88,10.16 21.71,10.32 21.71,12.43 21.03,13.11 20.49,13.11 20.34,13.27 20.34,16.04 21.02,16.72 22.25,16.72 23.64,18.11 23.64,19.2 23.16,19.68 23.16,20.17 23.89,20.91 23.89,21.24 U$2.18
B
  Top 0.254: R2.1 43.91,23.66 LED0.1
BCLK  (via drill 0.3)
  Top 0.13: U$2.32 24.48,27.6 24.48,28.03 | 24.48,28.03 | 24.48,28.03 24.93,28.48 v24.95,28.48
  Bottom 0.13: v24.95,28.48 23.48,27 16.9,27 15.5,25.6 12.34,25.6 SV2.20
BRD_RESET
  Top 0.152: 40.95,31.52 SW2.3
  Top 0.254: 40.95,31.52 R11.2 40.95,34.9 39.42,36.43 31.31,36.43 X2.6
CM  (via drill 0.3)
  Top 0.13: U$2.15 | U$2.8 19.75,23.4 | U$2.12 20.9,20.27 21.07,20.27 C13.1 21.4,20.4 U$2.13 | U$2.17 23.42,21.66 23.42,20.8 22.9,20.28 22.9,19.05 v22.98,18.98 | U$2.8 | v15.53,19.38 15.53,22.44 16.46,23.38 U$2.8 | C11.1 18.52,20.12 18.32,19.93 v18.32,19.38 | U$2.15 22.4,20.5 22.39,20.49 22.39,19.59 22.13,19.33 22.13,17.8 v21.9,17.57
  Top 0.254: C11.1 21.07,20.12 C13.1
  Bottom 0.13: v15.53,19.38 v18.32,19.38 22.57,19.38 v22.98,18.98 22.98,18.65 v21.9,17.57
D+  (via drill 0.3)
  Top 0.13: IC4.4 28.45,15.6 28.21,15.36 27.91,15.36 27.65,15.1 27.65,14.55 D1.2
  Top 0.254: v30.02,15.35 28.76,15.35 28.47,15.06 28.47,14.67 28.32,14.53 27.68,14.53 27.65,14.55 | U$1.P$3 40.03,15.45 39.75,15.17 39.74,15.17 v39.45,14.88
  Bottom 0.254: v30.02,15.35 31.2,15.35 32.75,16.9 36.1,16.9 38.12,14.88 v39.45,14.88
D-  (via drill 0.3)
  Top 0.16: IC4.5 28.95,17.07 29.02,17 29.02,16.65
  Top 0.254: 29.02,16.65 D1.4 29.9,16.43 v30.15,16.18 | U$1.P$2 39.75,16.1 v39.48,15.82
  Bottom 0.254: v30.15,16.18 31.49,16.18 32.59,17.28 36.26,17.28 37.71,15.83 38.9,15.83 38.91,15.82 v39.48,15.82
DAC_SDATA  (via drill 0.3)
  Top 0.13: U$2.33 23.9,28.3 v24.07,28.48
  Bottom 0.13: v24.07,28.48 22.86,27.27 16.79,27.27 16.32,26.8 15.2,26.8 15.19,26.8 SV2.21
EN
  Top 0.13: IC5.6 39.53,24.15 39.76,24.37 40.27,24.37 41.73,25.82 41.73,28.45 41.48,28.7 SW2.2
G
  Top 0.254: R4.1 43.92,21.43 LED0.4
GND  (via drill 0.3, 0.3 pad 0.45, 0.65 pad 0.45)
  Top 0.13: IC3.6 v0.93,15.05 | IC3.3 2.58,16.25 v2.67,16.15 2.77,16.25 IC3.50 2.77,16.98 | IC3.47 v3.98,16.15 3.77,15.95 IC3.51 | IC3.32 7.35,17.45 7.12,17.23 7.12,16.43 7.3,16.25 6.95,15.9 v6.95,15.45 | IC3.27 v6.95,15.45 | IC3.25 7.33,14.65 6.95,15.03 v6.95,15.45 | IC3.54 2.02,17.57 2.17,17.43 2.67,17.43 2.77,17.32 2.77,16.98 | 2.77,16.98 2.52,16.98 2.2,16.65 IC3.2 | J1.3 15.37,39.27 15.2,39.44 14.26,39.44 14.1,39.27 | J1.5 14.1,39.27 | 14.1,39.27 13.94,39.44 11.75,39.44 11.56,39.24 J1.9 | U$2.11 20.29,21.62 v19.18,21.62 | IC1.3 33.87,17.93 34.14,18.2 34.14,19.02 v34.1,19.07 | U$2.3 20.89,25.87 v21.15,26.12 21.15,25.4 19.77,25.4 U$2.4 | U$2.23 26.38,23.38 v26.5,23.25 | U$2.30 26.32,26.88 v26.48,27.02 | v21.15,24.62 20.9,24.88 U$2.5 | 29.57,28.1 C12.1 | v25.55,16.93 25.45,16.82 U$3.20 25.45,15.45 25.6,15.3 U$3.18 | U$3.11 25.45,13.07 25.26,13.27 24.84,13.27 24.65,13.07 U$3.9 v24.65,10.93 | R17.2 17.85,11.53 | R18.2 19.55,11.57 | R19.2 20.9,11.6 | v37.33,25.12 37.33,25.15 | U$2.20 25.38,21.73 25.48,21.62 25.48,21.12 v25.5,21.1 | C10.2 18.27,29 | 16.85,29.32 C17.2
  Top 0.16: IC3.29 7.3,16.25
  Top 0.2: IC4.12 28.95,19.98 | v2.67,16.15 v3.98,16.15
  Top 0.254: 37.81,14.15 C3.2 | C4.2 37.77,22.1 | IC5.7 37.33,24.65 | 37.33,25.65 IC5.9 39.58,25.65 39.83,25.9 40.33,25.9 SW2.1 | IC5.3 37.33,25.15 | 38.01,21.75 C4.2 | 33.37,16.01 IC1.EP 32.87,14.51 | IC1.3 | IC1.9 31.34,15.01 31.2,14.88 31.2,14.6 31.3,14.5 | 31.3,14.5 IC1.10 32.87,14.51 | 32.87,14.51 IC1.11 32.87,13.47 32.77,13.38 32.65,13.38 | 32.65,13.38 32.17,12.9 31.07,12.9 30.82,13.15 30.82,14.03 31.3,14.5 | 31,13.5 31.38,13.5 v31.4,13.53 | 32.65,13.38 32.65,13.45 32.6,13.5 | v37.8,13.32 37.83,13.68 37.81,13.7 | v41.12,20.15 | v41.12,20.15 42.88,20.15 U$1.S3 | C4.2 37.75,21.96 | 28.95,19.98 IC4.GND 27.95,18.98 IC4.3 27.95,16.52 D1.1 27.7,16.23 27.38,16.65 26.77,16.65 v26.75,16.68 | U$1.S4 42.95,10.75 41.22,10.75 v41.23,10.7 41.23,12.08 U$1.S2 | R1.1 v34.02,20.7 | C19.2 v24.65,18.02 | IC3.53 2.02,22.6 v2.67,23.25 | v41.12,20.15 41.12,18.72 U$1.S1 | C16.1 29.57,28.1 | C13.2 19.43,18.85 C11.2 | C24.2 29.23,12.75 | LED2.C 31.73,29.77 v30.9,29.77
  Top 0.35: 39.3,14.15 U$1.P$5 39.92,14.15 v39.33,13.55 | 39.3,14.15 38.75,14.15 | 38.75,14.15 38.73,14.15 | 38.73,14.15 37.81,14.15 | v39.33,13.55 38.73,14.15 | v39.33,13.55 39.33,14.12 39.3,14.15 | 39.3,14.15 39.3,14.07 39.16,14.17 38.75,14.58 38.75,14.7 38.6,14.85 38.3,14.85 38.75,14.4 38.75,14.15
  Top 0.406: 32.58,14.22 31.38,14.22 31.02,13.88 32.7,13.88 32.73,13.93 32.73,13.62 32.6,13.5 31,13.5 31,13.28 31.1,13.18 32.2,13.18 32.23,13.2 | J1.9 10.61,37.66 v10.57,37.62 | R16.2 R17.2 | 17.85,11.53 v17.85,12.4 | 19.55,11.57 v19.55,12.4 | 20.9,11.6 v20.9,12.4 | v18.23,18.27 19.45,18.27 C11.2 | C27.2 v30.9,20.8 | C10.2 17.1,29.07 C17.2 | v17.57,25.5 18.32,25.5 C15.2 | IC3.56 5.03,19.07 v5.03,20.45 v5.03,21.8 v5.03,23.25
  Top 0.61: R6.1 R5.1 31.98,10.93 v31.77,11.12
  Top 0.813: BAT.2 38.01,11.85 37.81,12.05 | C1.2 v37.74,20.57 v37.75,20.57 37.77,20.6 C4.2
  Top 1.016: 37.77,22.1 37.77,23.05 37.33,23.5 37.33,24.65 37.33,25.15 37.33,25.65 37.33,28.2 C5.2 | 37.74,21.96 C4.2 | 37.81,14.15 37.81,13.7 37.81,12.05 C2.2
  Bottom 0.61: JP5.1 41.16,7.89 41.1,7.89 39.33,9.66 v39.33,13.55
  other vias: 0.93,23.25 0.93,13.3 0.93,16.15 0.93,27.25 8.65,13.7 7.5,23.25 3.98,14.5 5.78,14.5 0.93,9.1 0.93,0.85 0.93,39.15 3.42,0.85 5.92,0.85 8.43,0.85 5.03,39.15 5.03,28.57 7.47,39.15 37.38,29.3 37.38,30.9 37.38,30.1 28.2,19.23 0.93,31.25 0.93,35.25 0.93,4.9 5.03,33.89 38.25,30.9 38.25,30.1 38.25,29.3 37.33,26.02 37.33,24.27 22.65,24.62 22.65,26.12 22.65,23.12 24.15,24.62 24.15,23.12 21.15,23.12 24.15,26.12 22.35,10.53 30.05,13.03 27.52,8.5 8.43,3.33 8.43,5.72 8.43,8.28 7.5,26.02 7.5,28.65 7.5,35.25 30.65,22.38 30.7,24.62 16.07,24.93 16.8,21.4 27.77,30.93 16.88,30.43 18.6,32.52 18.6,35.25 18.6,39.15 23.27,9.45 28.02,10.47 20.98,31.62 19.73,30.3 33.87,15.51 33.23,16.15 34.5,16.15 33.23,14.88 34.5,14.88
  pour Top (isolate 0.254, rank 6): -0.25,40.25 -0.25,22.6 4.7,22.6 4.7,17.38 -0.25,17.38 -0.25,-0.2 30.75,-0.2 30.75,13.65 27.05,13.65 27.05,16.15 26.2,16.15 26.2,22.27 29.35,22.27 29.35,21.6 31.4,21.6 31.4,28.75 38.95,28.75 38.95,40.25
  pour Bottom (isolate 0.254, rank 6): -0.25,40.25 -0.25,22.6 4.7,22.6 4.7,17.35 -0.25,17.35 -0.25,-0.2 30.75,-0.2 30.75,13.65 27.05,13.65 27.05,16.15 26.2,16.15 26.2,22.27 29.35,22.27 29.35,21.6 31.4,21.6 31.4,28.75 38.95,28.75 38.95,40.25
  pour Route2 (isolate 0.254, rank 6): -0.25,40.25 -0.25,22.6 4.7,22.6 4.7,17.35 -0.25,17.35 -0.25,-0.2 30.75,-0.2 30.75,13.65 27.05,13.65 27.05,16.15 26.2,16.15 26.2,22.27 29.35,22.27 29.35,21.6 31.4,21.6 31.4,28.75 38.95,28.75 38.95,40.25
  pour Route2 (isolate 0.254, rank 6): 31.18,-0.2 31.18,13.93 27.32,13.93 27.32,16.43 26.48,16.43 26.48,21.88 29.07,21.88 29.07,21.32 31.68,21.32 31.68,28.48 39.23,28.48 39.23,40.25 45.25,40.25 45.25,-0.2
  pour Bottom (isolate 0.254): 31.18,-0.2 45.25,-0.2 45.25,40.25 39.23,40.25 39.23,28.48 31.68,28.48 31.68,21.32 29.07,21.32 29.07,21.88 26.48,21.88 26.48,16.43 27.32,16.43 27.32,13.93 31.18,13.93
HPOUTL  (via drill 0.3)
  Top 0.13: U$2.22 25.59,22.82 26.09,22.82 26.57,22.34 28.03,22.34 v28.27,22.1
  Top 0.406: v26.82,9.97 25.65,9.97 C21.+
  Bottom 0.13: 26.14,12.37 26.15,12.37 | 26.14,12.37 26.14,14.51 29.32,17.69 29.32,21.05 v28.27,22.1 | v26.82,9.97 26.14,10.65 26.14,12.37
HPOUTR  (via drill 0.3)
  Top 0.13: v26.52,24.88 U$2.26
  Top 0.406: v29.65,11.18 29.65,9.62 C23.+
  Bottom 0.13: v29.65,11.18 27.7,11.18 26.4,12.47 26.41,12.48 26.41,14.41 29.58,17.58 29.58,21.82 v26.52,24.88
LRCLK  (via drill 0.3)
  Top 0.13: U$2.31 25.52,27.52 25.7,27.7 v25.7,28.07
  Bottom 0.13: v25.7,28.07 24.35,26.73 17.01,26.73 14.55,24.27 SV2.19
MCLKI  (via drill 0.3)
  Top 0.2: v19.9,29.1 19.93,29.07 R23.2 U$2.39
  Bottom 0.2: v19.9,29.1 13.79,29.1 SV2.23
MIC0  (via drill 0.3)
  Top 0.13: R16.1 16.1,10.18 v16.1,9.33
  Top 0.406: C6.1 16,4.02 SV1.2
  Bottom 0.13: v16.1,9.33 16.1,8.98 16.9,8.18 16.9,6.95 16.8,6.85 JP1.2
  Bottom 0.406: JP1.2 16,4.02 SV1.2
MIC1  (via drill 0.3)
  Top 0.13: R17.1 v17.82,9.33 17.35,9.33 17.07,9.05 17.07,6.65 17.27,6.45 C7.1
  Top 0.406: C7.1 18.15,4.41 SV1.4
  Bottom 0.406: JP2.2 18.15,4.41 SV1.4
MIC2  (via drill 0.3)
  Top 0.13: R18.1 v19.48,9.33 19.48,9.12 19.16,8.81 19.16,7.42 19.18,7.42 19.18,6.67 19.4,6.45 C8.1
  Top 0.406: C8.1 20.27,4.83 SV1.6
  Bottom 0.406: JP3.2 20.27,4.83 SV1.6
MIC3  (via drill 0.3)
  Top 0.13: R19.1 v20.93,9.33 21.35,8.9 21.35,6.6 21.5,6.45 C9.1
  Top 0.406: C9.1 22.4,5.24 SV1.8
  Bottom 0.406: JP4.2 22.4,5.24 SV1.8
MICBIAS0  (via drill 0.3)
  Top 0.13: U$2.6 18.5,24.38 C15.1
  Top 0.406: C15.1 16.5,24.32 14.78,22.61 14.78,17.79 v15.45,17.12 R7.1 | v16.9,17.12 R8.1 R9.1 R10.1
  Bottom 0.406: v16.9,17.12 v15.45,17.12
N$1
  Top 0.254: IC5.4 35.2,24.65 | 35.2,24.65 33.1,24.65 32.9,24.45 L1.2 | 35.2,24.65 34.42,23.88 34.42,23.3 34.3,23.18 33.9,23.18 34.05,23.32 34.25,23.32 34.25,24.02 34.23,24.05 34.33,24.05 34.77,24.5 33.27,24.5 33.02,24.25 34.35,24.25 34.38,24.27
N$2
  Top 0.254: IC5.2 35.35,25.65 | 35.35,25.65 33.1,25.65 32.9,25.85 L1.1 | 35.35,25.65 34.73,26.27 34.73,26.62 34.35,27 34.02,27 34.52,26.5 34.55,26.5 34.55,26.2 34.85,25.9 | 34.95,25.8 34.85,25.9 | 34.85,25.9 34.33,25.9 | 33.1,25.9 34.33,25.9 | 34.33,25.9 34.48,26.05 34.42,26.1 34.2,26.1 34.2,26.57 34.38,26.4 34.38,26.3
N$3
  Top 0.13: IC3.48 3.58,16.6 3.48,16.5 3.27,16.5 3.17,16.6 IC3.49
N$4
  Top 0.13: IC3.5 1.48,15.45 1.38,15.55 1.38,15.75 1.48,15.85 IC3.4
N$5
  Top 0.13: C25.1 25.2,11.45 25.05,11.6 U$3.10
N$6  (via drill 0.3)
  Top 0.406: R7.2 15.45,14.02 v15.43,14
  Bottom 0.254: v15.43,14 15.43,8.97 15.78,8.62 15.78,7.98 JP1.1
N$7  (via drill 0.3)
  Top 0.406: R8.2 v16.9,14.03
  Bottom 0.254: v16.9,14.03 16.9,9.25 17.85,8.3 17.85,7.97 JP2.1
N$8  (via drill 0.3)
  Top 0.406: R9.2 18,14.05 v18.02,14.02
  Bottom 0.254: v18.02,14.02 18.82,13.23 18.82,9.06 18.82,9.05 18.82,8.97 19.25,8.55 20.02,8.55 20.27,8.3 JP3.1
N$9
  Top 0.2: R23.1 21.52,30.38 21.66,30.23 21.66,29.82 21.86,29.62 Y1.P$3
N$10  (via drill 0.3)
  Top 0.406: R10.2 v19.1,14.04 v19.09,14.03
  Bottom 0.254: v19.09,14.03 20.24,12.88 20.24,10.94 22.38,8.81 22.38,7.78
  Bottom 0.406: 22.38,7.78 JP4.1
N$12
  Route3 0.13: 42.27,7.33 41.67,7.92 41.67,9.32 42.25,9.9 43.67,9.9 44.27,9.3 44.27,7.92 43.67,7.33 42.27,7.33
N$13
  Route3 0.13: 38.52,17.25 38.52,17.85 38.85,18.18 39.5,18.18 39.85,17.82 39.85,17.2 39.48,16.88 38.9,16.88 38.52,17.25
N$14  (via drill 0.3)
  Top 0.13: 29.75,18.4 IC4.7 30.9,18.48 C27.1 | IC1.4 33.37,18.27 v33.55,18.45 | v34.77,19.57 34.69,19.49 34.69,18.83 34.4,18.54 34.4,18.1 34.37,18.07 IC1.2 | 30.9,18.98 C27.1 | IC4.8 30.9,18.98 | 30.9,18.98 31.12,18.98 C27.1 | 36.34,16.01 36.27,15.95 36.23,15.95 | 36.53,15.51 36.55,15.53 36.55,15.62 | 36.58,15.35 36.6,15.32
  Top 0.15: 36.17,15.95 36.23,15.95 36.38,15.8 36.38,15.72 36.2,15.55 | 36.23,15.45 36.38,15.3 36.38,15.2 36.3,15.12 | 36.25,15.07 36.3,15.12 | 36.3,15.12 36.45,15.12 36.45,15.32 36.6,15.32 37.05,15.78
  Top 0.16: 36.53,15.51 36.48,15.45 36.58,15.35 36.58,15.15 36.48,15.05 35.87,15.05 IC1.17 | IC4.7 30,18.48 30.05,18.43
  Top 0.254: 37.81,16.75 C3.1 | IC1.19 36.34,16.01 36.58,16.25 36.58,16.55 36.77,16.75 37.37,16.75 C3.1 | IC1.18 36.53,15.51 36.88,15.85 37.35,15.85 C3.1 | LED0.2 42.95,22.98 v42.92,22.95 | v30.15,14.5 29.23,14.5 D1.3
  Top 0.305: 38.4,16 38.6,16 39.35,16.75 | 39.1,16.75 38.8,16.45
  Top 0.35: U$1.P$1 40.02,16.75 | 40.02,16.75 39.52,16.75 | 39.52,16.75 39.35,16.75 39.1,16.75 38.83,16.75 37.81,16.75 | 40.02,16.75 39.25,17.52 v39.2,17.52 39.52,17.2 39.52,16.75
  Top 0.406: 36.55,15.62 36.55,15.97 36.6,16.02 36.9,16.02 36.9,16.5 | C27.1 30.8,18.62 v30.8,17.93
  Top 0.508: 38.8,16.45 38.55,16.4
  Top 0.61: 37.81,16.75 37.81,17.53 v37.83,17.55 | v39.2,17.52 39.2,17.12 38.83,16.75
  Bottom 0.61: JP5.2 42.97,8.62 41.4,8.62 40.35,9.68 40.35,17.02 39.83,17.55 39.23,17.55 v39.2,17.52
  pour Route3 (isolate 0.254, rank 6): 31.18,-0.2 31.18,13.93 27.32,13.93 27.32,16.43 26.48,16.43 26.48,21.88 29.07,21.88 29.07,21.32 31.68,21.32 31.68,28.48 39.23,28.48 39.23,40.25 45.25,40.25 45.25,-0.2
N$15
  Bottom 0.13: 39.85,14.18 38.98,14.18 38.7,13.9 38.7,8.45 42.35,4.8 43.6,4.8 44.23,5.42 44.23,6.72 43.62,7.33 42.58,7.33
N$16
  Route2 0.13: 38.67,13.15 38.67,13.9 38.98,14.2 39.1,14.2 39.85,14.2 40.02,14.03 40.02,13.18 39.75,12.9 38.92,12.9 38.67,13.15 | 38.67,13.15 38.67,8.47 41.7,5.45 | 41.7,5.45 42.35,4.8 43.6,4.8 44.23,5.42 44.23,6.72 43.62,7.33 42.3,7.33 41.7,6.72 41.7,5.45
N$17  (via drill 0.3)
  Top 0.13: R2.2 39.98,23.66 v39.88,23.65 | IC1.6 31.9,16.9 32.41,17.41 32.41,21.26 33.15,22 34.42,22 v34.45,22.02
  Bottom 0.13: v39.88,23.65 39.77,23.65 38.31,22.19 35,22.19 34.84,22.02 v34.45,22.02
N$18  (via drill 0.3, 0.35)
  Top 0.13: R3.2 v39.88,22.54 | IC1.7 31.39,16.01 31.25,16.15 31.25,16.96 v31.1,17.11
  Top 0.254: IC1.7
  Bottom 0.13: v39.88,22.54 39.2,22.54 38.47,21.81 35.16,21.81 34.72,21.37 33.85,21.37 31.96,19.48 31.96,17.98 v31.1,17.11
N$19
  Top 0.254: LED2.A 33.15,29.9 R20.1
N$29  (via drill 0.3, 0.33)
  Top 0.13: v39.88,21.43 R4.2 | IC1.8 31.14,15.51 30.74,15.91 30.74,16.49 v30.21,17.02
  Top 0.254: 31.88,15.53 IC1.8 | R4.2
  Bottom 0.13: v39.88,21.43 35.68,21.43 34.3,20.04 33.75,20.04 32.22,18.51 32.22,17.36 31.36,16.5 30.84,16.5 30.31,17.02 v30.21,17.02
N$30
  Top 0.254: IC1.5 32.87,19.14 R1.2
N$31
  Top 0.254: IC1.12 33.37,13.02 33.02,12.68 33.02,12.33 R5.2
N$32
  Top 0.254: IC1.13 33.87,12.06 R6.2
OUTL
  Top 0.406: C21.- 25.2,6.22 R13.1 26.93,4.63 SV1.10
OUTR
  Top 0.406: C23.- 29.75,6.22 R12.1 28.02,4.7 SV1.12
PA0  (via drill 0.3)
  Top 0.13: IC3.14 3.98,13.31 3.98,11.75 4.69,11.05 4.69,11.04 v5.04,10.69
  Bottom 0.13: SV2.7 12.46,9.03 11.43,10.05 10.38,10.05 9.68,9.35 5.49,9.35 5.06,9.78 5.06,10.67 v5.04,10.69
PA1  (via drill 0.3)
  Top 0.13: IC3.15 4.38,12.2 5.65,10.93 v5.65,10.03
  Bottom 0.13: v5.65,10.03 6.07,9.61 9.57,9.61 10.27,10.31 10.53,10.31 11.01,10.78 SV2.10
PA2  (via drill 0.3)
  Top 0.13: IC3.16 4.79,13.31 4.79,12.15 5.91,11.03 5.91,10.99 v6.25,10.64 | SV2.9 12.52,10.54 9.43,10.54 v9.32,10.64
  Bottom 0.13: v6.25,10.64 v9.32,10.64
PA3  (via drill 0.3)
  Top 0.13: IC3.17 5.17,12.18 6.11,11.24 v6.85,11.24
  Bottom 0.13: v6.85,11.24 9.23,11.24 10.58,12.59 12.03,12.59 SV2.11
PA4  (via drill 0.3)
  Top 0.13: v6.29,11.89 v6.29,11.9 5.81,11.9 5.58,12.14 IC3.18
  Bottom 0.13: v6.29,11.89 9.49,11.89 11.01,13.4 SV2.12
PD9  (via drill 0.3)
  Top 0.13: IC3.7 1.91,14.69 2.23,14.69 2.55,15 v2.67,15
  Bottom 0.13: v2.67,15 2.67,14.95 3.25,14.38 3.25,12.47 2.04,11.26 2.04,5.81 3.9,3.94 SV2.4
PD10  (via drill 0.3)
  Top 0.13: IC3.8 2.53,14.25 v2.65,14.13
  Bottom 0.13: SV2.1 12.28,2.67 3.48,2.67 1.78,4.37 1.78,11.37 2.65,12.24 v2.65,14.13
PD11  (via drill 0.3)
  Top 0.13: IC3.9 v1.88,12.3
  Bottom 0.13: 10.87,1.41 SV2.2 8.71,1.41 8.67,1.44 4.08,1.44 1.52,4 1.52,11.95 v1.88,12.3
PD12  (via drill 0.3)
  Top 0.13: IC3.10 2.38,12.64 2.47,12.55 2.47,10.85 v2.64,10.67
  Bottom 0.13: SV2.3 12.46,3.94 11.43,4.97 3.58,4.97 2.64,5.91 v2.64,10.67
PD13  (via drill 0.3)
  Top 0.13: 2.81,13.31 IC3.11 2.77,11.4 3.24,10.94 v3.24,9.99
  Bottom 0.13: SV2.6 4.37,6.49 3.24,7.61 v3.24,9.99
PD14  (via drill 0.3)
  Top 0.13: IC3.12 3.19,13.29 3.19,11.37 3.83,10.71 v3.83,10.69
  Bottom 0.13: SV2.5 12.46,6.49 11.43,7.51 4.76,7.51 3.83,8.44 v3.83,10.69
PD15  (via drill 0.3)
  Top 0.13: IC3.13 3.58,13.31 3.58,11.79 4.43,10.95 v4.43,10.03
  Bottom 0.13: SV2.8 5.17,9.03 4.43,9.77 v4.43,10.03
R
  Top 0.254: LED0.3 43.8,22.1 42.77,22.1 42.58,22.3 42.28,22.3 R3.1
RESET  (via drill 0.3)
  Top 0.13: J1.10 11.12,33.59 8.9,31.38 v8.9,31.32 | v0.93,17.02 0.95,17.05 IC3.1
  Bottom 0.13: v8.9,31.32 8.88,31.32 6.88,29.33 6.88,23.5 6.88,23 7.36,22.53 7.36,20.4 7.36,20.34 7.36,19.85 7.36,17.54 6.77,16.95 6.28,16.95 6.13,17.09 5.88,17.35 1.25,17.35 v0.93,17.02
SCL  (via drill 0.3, 0.35)
  Top 0.13: IC3.37 6.79,19.48 6.96,19.66 7.29,19.66 7.72,20.1 v7.95,20.1 8.27,20.1 8.42,20.24 11.4,20.24 12.03,19.61 12.03,17.67 SV2.14 | U$3.23 24.25,16.48 23.91,16.82 22.71,16.82 22.36,16.47 21.64,16.47 v21.05,15.88 R15.2 | U$2.2 17.6,26.38 16.75,25.52 9.68,25.52 v9.62,25.57
  Bottom 0.13: v7.95,20.1 8.61,20.76 8.75,20.76 9.62,21.64 v9.62,25.57 9.98,25.93 9.98,29.77 10.58,30.37 15.37,30.37 16.35,31.35 19.54,31.35 23.54,35.35 X2.1 | SV2.14 12.03,15.62 13.97,15.62 14.55,16.2 20.73,16.2 v21.05,15.88
SDA  (via drill 0.3, 0.35)
  Top 0.13: IC3.38 6.38,19.48 6.57,19.66 6.6,19.66 8.28,21.34 v8.49,21.34 | v8.49,21.34 v8.5,21.35 | U$2.1 18.23,26.88 17.98,26.63 17.49,26.63 16.64,25.78 10.26,25.78 9.41,26.62 v9.18,26.62 | v8.49,21.34 9.34,20.5 11.5,20.5 12.29,19.72 12.29,17.9 SV2.13 | U$3.24 23.85,16.45 23.75,16.55 22.8,16.55 22.1,15.85 22.05,15.85 | 22.05,15.85 v22.02,15.85 | R14.2 22.05,15.05 22.05,15.85
  Bottom 0.13: v8.5,21.35 9.03,21.88 9.03,25.82 9.18,25.96 v9.18,26.62 9.18,29.68 10.25,30.75 15.39,30.75 16.24,31.61 19.43,31.61 24.2,36.37 25.19,36.37 26.2,35.35 X2.3 | v22.02,15.85 22,15.85 21.36,16.49 13.7,16.49 SV2.13
SWCLK  (via drill 0.3)
  Top 0.13: v6.22,20.35 5.97,20.1 IC3.39 | J1.4 15.37,35.35 14.98,35.74 10.69,35.74 v8.9,33.95
  Bottom 0.13: v6.22,20.36 v6.22,20.35 6.56,20.69 6.56,22.24 6.11,22.69 6.11,31.16 v8.9,33.95
SWDIO  (via drill 0.3)
  Top 0.13: IC3.40 5.58,20.02 5.63,20.08 5.63,20.6 5.95,20.91 v5.95,21.18 | J1.2 16.64,35.05 15.7,35.99 10.43,35.99 9.28,34.85 v8.93,34.85
  Bottom 0.13: v5.95,21.18 5.95,22.49 5.86,22.59 5.86,31.78 v8.93,34.85
SWO  (via drill 0.3)
  Top 0.13: J1.6 14.1,35.24 13.88,35.46 11.28,35.46 10.91,35.1 10.91,35.06 v8.9,33.05 | v6.42,18.37 6.3,18.25 IC3.41
  Bottom 0.13: v6.42,18.37 6.42,19.71 6.82,20.1 6.82,22.34 6.37,22.79 6.37,30.53 8.63,32.79 8.64,32.79 v8.9,33.05
TDI  (via drill 0.3)
  Top 0.13: IC3.42 5.74,17.84 6.04,17.84 6.33,17.54 v6.53,17.54 | J1.8 12.83,31.88 12.55,31.6 10.02,31.6 8.79,30.38 v7.08,30.38
  Bottom 0.13: v6.53,17.54 6.53,17.63 7.1,18.21 7.1,19.74 7.1,19.75 7.1,21 | 6.62,23.6 6.62,22.9 7.1,22.42 7.1,21 | 6.62,23.6 | 6.62,23.6 6.62,29.92 v7.08,30.38 | 7.1,21 7.1,21.05
UART_CTS  (via drill 0.3, 0.35)
  Top 0.13: IC3.35 8.65,18.65 v8.75,18.75 | IC4.16 26.95,21.03 v26.75,21.23
  Bottom 0.13: v8.75,18.75 9.1,18.75 10.61,20.25 14.55,20.25 14.85,20.55 19.3,20.55 19.78,21.03 24.59,21.03 25.25,21.69 26.29,21.69 v26.75,21.23
UART_RTS  (via drill 0.3, 0.35)
  Top 0.13: v8.68,19.62 8.33,19.62 8.2,19.49 7.52,19.49 IC3.36 | IC4.15 27.45,21.73 v27.43,21.75
  Bottom 0.13: v8.68,19.62 9.56,20.51 14.41,20.51 14.71,20.81 19.2,20.81 19.67,21.28 24.48,21.28 25.15,21.95 27.23,21.95 v27.43,21.75
UART_RX  (via drill 0.3, 0.35)
  Top 0.13: IC4.18 26.64,19.46 26.14,19.46 25.82,19.15 v25.65,19.15 | v8.65,17.5 8.3,17.85 IC3.33
  Bottom 0.13: v8.65,17.5 v8.66,17.51 9.64,17.51 10.04,17.9 13.97,17.9 13.98,17.9 14.08,17.9 14.83,18.65 14.83,19.55 15.32,20.04 19.51,20.04 19.99,20.52 24,20.52 25.36,19.15 v25.65,19.15
UART_TX  (via drill 0.3, 0.35)
  Top 0.13: IC4.17 v25.68,19.98 | v9.39,18.12 9.02,18.12 9.01,18.12 8.51,18.12 8.38,18.25 7.7,18.25
  Top 0.152: IC3.34 7.7,18.25
  Bottom 0.13: v9.39,18.12 9.42,18.16 13.97,18.16 14.57,18.76 14.57,19.66 15.2,20.3 19.41,20.3 19.89,20.77 24.1,20.77 24.33,20.55 25.1,20.55 v25.68,19.98
VBAT  (via drill 0.5)
  Top 0.254: IC1.14 34.37,13.16 34.65,12.88 34.65,11.62 34.92,11.35 35.57,11.35 C2.1 36.16,11.94 36.58,12.36 36.58,13.57 36.02,14.12 36.02,14.38 35.89,14.51 IC1.16 35.62,14.5 35.62,14.05 | IC1.15 34.87,13.59 35,13.72 35.38,13.72 35.62,13.97 35.62,14.05 | v34.95,11.95 35,11.9 | 35.85,14.07 35.65,14.07 35.62,14.05
  Top 0.61: 35.6,11.57 35.23,11.57 35,11.8 35,11.9 35,12.82 34.83,12.85 35.17,13.2 35.55,13.35 35.25,13.4 35.85,13.82 35.85,13.88 | 35.85,14.07 35.85,13.88 | 35.85,13.88 36.25,13.47 36.25,12.88 36.08,12.88 35.77,13.18 35.3,13.18 35.3,12.07 35.38,12 35.38,12.3 35.7,12.62
  Top 0.813: BAT.1 36.01,11.8 36.16,11.94
VDD  (via drill 0.3)  (1 unrouted)
  Top 0.13: IC3.26 8.35,15.05 v8.65,15.35 8.65,16.4 8,17.05 IC3.31 | U$2.19 24.4,20.33 C19.1 24.4,20.23 | U$2.27 26.18,25.38 26.28,25.47 28.09,25.47 C14.2 | U$2.28 28.05,25.88 C14.2 | C16.2 26.91,26.62 26.72,26.43 25.61,26.43 U$2.29 | 28.27,28.1 C12.2 27.77,28.6 | U$2.24 28.12,23.88 28.18,23.82 | 28.18,23.82 C20.1 | 28.25,23.9 28.18,23.82 | 28.25,25.52 C14.2 | C26.1 24.1,11.45 24.25,11.6 U$3.8 | U$3.13 27.62,13.3 C24.1 | U$3.22 24.65,16.9 v24.68,16.93 | U$3.1 23.15,15.8 v23.02,15.93 | U$2.40 18.7,27.52 C10.1 | U$2.10 18.18,22.38 C18.1
  Top 0.254: C5.1 36.08,27.9 36.08,26.3 35.92,26.15 IC5.1 35.62,26.15 35.58,26.2 35.58,26.4 35.23,26.75 35.23,27.65 35.27,27.7 35.62,27.7 | IC5.10 v38.8,26.98 | Y1.P$4 C22.1 v26.38,28.6 27.77,28.6 | R15.1 R14.1 v22.12,12.93 | C16.2 28.27,28.1 | 28.25,23.9 v28.25,24.65 28.25,25.52 | v23.75,19.93 24.45,19.93 C19.1 | C26.1 23.62,10.82 v23.25,10.55 | v27.9,12.12 C24.1 | R20.2 v30.95,30.93
  Top 0.406: J1.1 17.64,37.66 v17.68,37.62 | C10.1 17.05,27.77 C17.1 16.82,27.65 v15.55,27.65 | C18.1 v17.12,22.23
  Top 0.61: C5.1 35.67,29.3 v35.7,29.3
  Top 0.813: 35.62,27.7 35.62,26.95 35.77,26.8 35.77,26.65
  Bottom 0.254: v38.8,26.98 38.02,26.98 v35.7,29.3
  other vias: 34.85,30.9 35.7,30.9 35.7,30.1 34.85,30.1 34.85,29.3
  pour Route3 (isolate 0.254, rank 6): -0.25,40.25 -0.25,22.6 4.7,22.6 4.7,17.35 -0.25,17.35 -0.25,-0.2 30.75,-0.2 30.75,13.65 27.05,13.65 27.05,16.15 26.2,16.15 26.2,22.27 29.35,22.27 29.35,21.6 31.4,21.6 31.4,28.75 38.95,28.75 38.95,40.25
  pour Top (isolate 0.254, no thermals): 35.15,28.32 35.15,28.82 35.05,28.93 35.02,28.95 34.6,28.95 34.48,29.07 34.48,31.02 34.48,31.12 34.67,31.32 34.67,31.35 35.92,31.35 36.1,31.18 36.1,28.32
VIN  (via drill 0.3)
  Top 0.16: 35.83,16.65 IC1.20
  Top 0.254: C4.1 36.08,22.3 36.52,22.75 36.52,23.25 36.12,23.65 36.12,23.75 | IC5.5 36.12,24.15 36.12,23.75 | 35.58,24.1 35.58,23.9 35.48,23.8 35.02,23.8 34.92,23.7 34.92,23.25 35.17,23 35.42,23 35.58,22.85 35.58,22.65 36.02,22.65 | 35.88,23.75 36.12,23.75 | IC1.1 34.87,17.94 35.08,18.15 35.48,18.15 35.58,18.25 35.58,18.68 C1.1 36.52,18.66 36.52,17.3 36.02,16.8 36.02,16.65 35.88,16.51 IC1.20 | 34.88,17.25 35.33,17.25 35.62,16.95 35.62,16.65 35.83,16.65 | IC5.8 39.77,25.15 v39.88,25.05 | R11.1 43.52,33.02 v43.55,33
  Top 0.406: 35.83,16.65 35.83,16.9
  Top 0.61: 35.77,23.35 35.33,23.35 35.23,23.45 v35.33,23.45 35.58,23.45 35.88,23.75 | 35.83,16.9 35.83,17.2 35.58,17.45 35.38,17.45 35.27,17.55 35.27,17.8 35.48,17.8 35.88,18.2 36.17,18.2 36.17,17.35 35.98,17.55
  Top 1.016: 36.02,22.65 36.02,22.95 35.98,23 35.98,23.15 35.77,23.35 | C1.1 36.04,21.96 C4.1
  Bottom 0.254: v35.33,23.45 38.48,23.45 39.88,24.85 v39.88,25.05 39.88,31.3 41.6,33.02 43.52,33.02 v43.55,33

### Text on the board
tPlace: SWD | v0.8 | USBi | uMI9s | Y | Li-Po | Z | X | MPU-9250
bPlace: ON | MCLK | ADCSDATA1 | DAC_SDATA | ADC_SDATA0 | LRCLK | OFF | BCLK | GND x2 | 3V3 x2 | SCL | SDA | PA3 | PA4 | PA2 | PA1 | PA0 | +5V | PD15 | MICBIAS | PD14 | PD13 | OUTL | OUTR | PD12 | IN0 | IN1 | IN2 | IN3 | PD9 | GND | PD10 | GND x6 | PD11